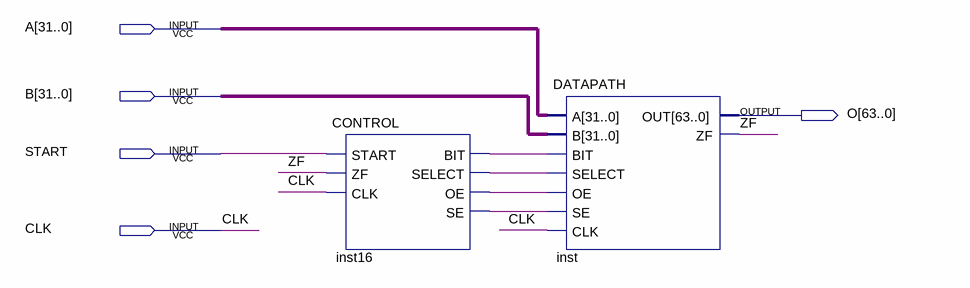
[diagram p0: schematic sheet]
// Quartus schematic MUL32BIT.bdf as structural Verilog: 2 symbols, 5 pins
module MUL32BIT (
  input  [31:0] A,
  input  [31:0] B,
  input  START,
  input  CLK,
  output [63:0] O
);

  wire inst16_bit, inst16_oe, inst16_se, inst16_select, ZF;

  CONTROL inst16 (
    .START(START), .ZF(ZF), .CLK(CLK), .BIT(inst16_bit), .SELECT(inst16_select), .OE(inst16_oe),
    .SE(inst16_se));
  DATAPATH inst (
    .A(A), .B(B), .BIT(inst16_bit), .SELECT(inst16_select), .OE(inst16_oe), .SE(inst16_se), .CLK(CLK),
    .OUT(O), .ZF(ZF));
endmodule
